# Altium schematic sheet Sheet2.SchDoc
size A4
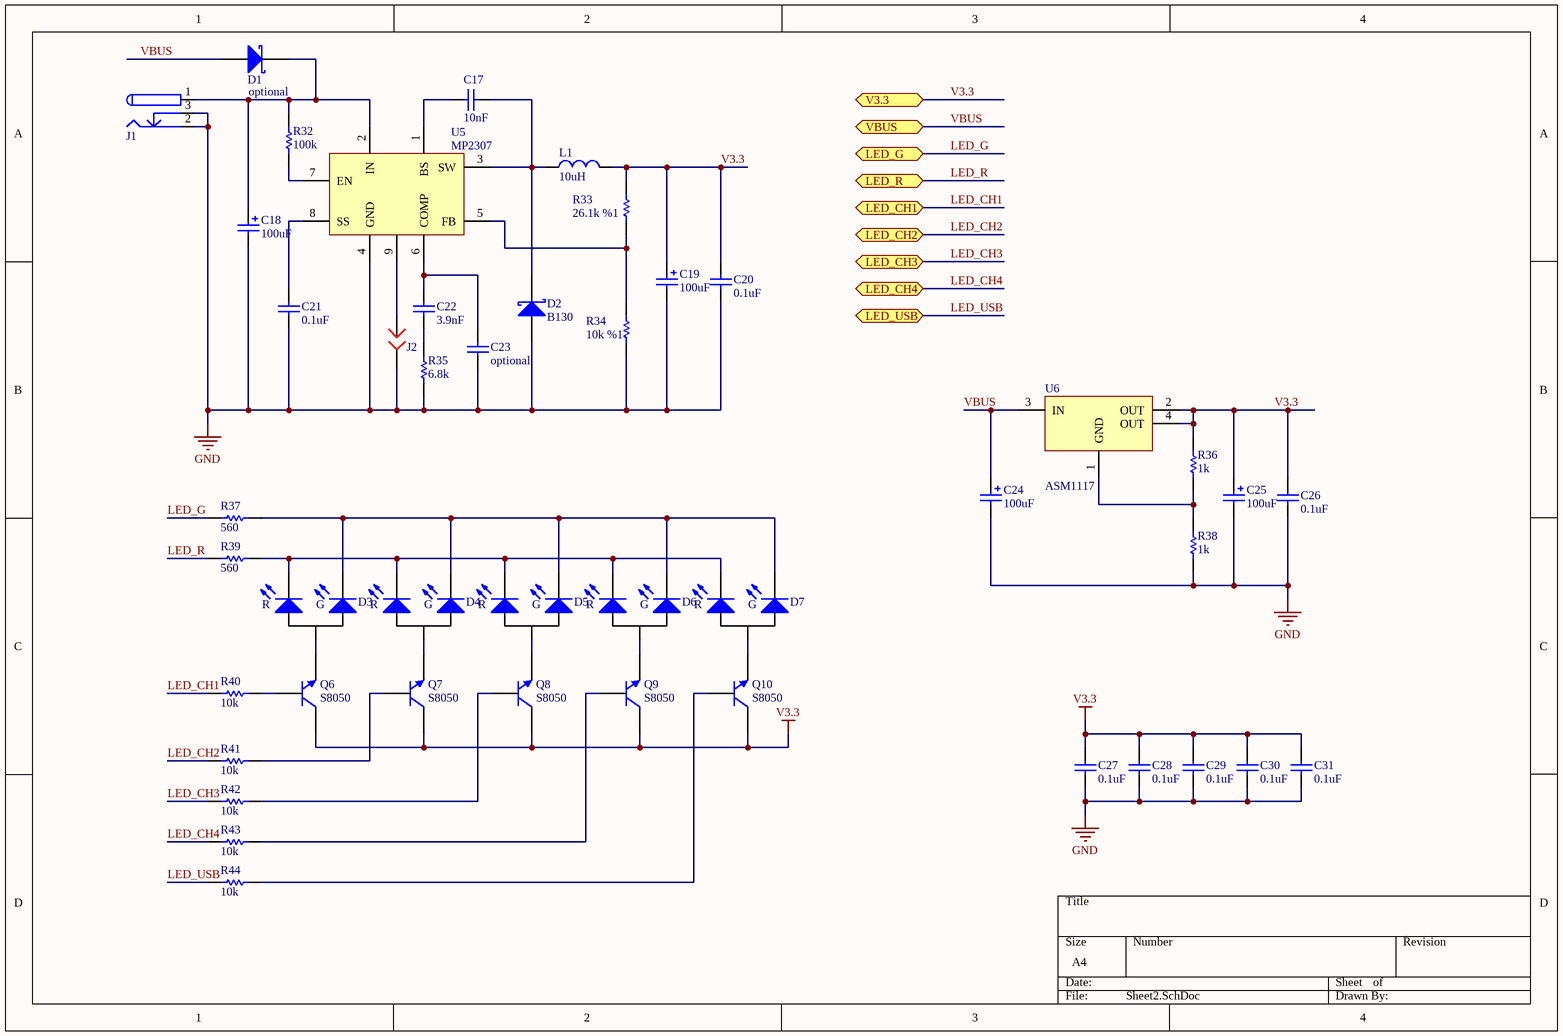
[diagram p0: Sheet2.SchDoc]

## Parts
C17  value 10nF  [0805]  (hidden comment: Cap)
C18  value 100uF  [1206A]  (hidden comment: Cap)
C19  value 100uF  [1206A]  (hidden comment: Cap)
C20  value 0.1uF  [0805]  (hidden comment: Cap)
C21  value 0.1uF  [0805]  (hidden comment: Cap)
C22  value 3.9nF  [0805]  (hidden comment: Cap)
C23  value optional  [0805]  (hidden comment: Cap)
C24  value 100uF  [0805A]  (hidden comment: Cap)
C25  value 100uF  [0805A]  (hidden comment: Cap)
C26  value 0.1uF  [0805]  (hidden comment: Cap)
C27  value 0.1uF  [0805]  (hidden comment: Cap)
C28  value 0.1uF  [0805]  (hidden comment: Cap)
C29  value 0.1uF  [0805]  (hidden comment: Cap)
C30  value 0.1uF  [0805]  (hidden comment: Cap)
C31  value 0.1uF  [0805]  (hidden comment: Cap)
D1  optional  [SMA_DO-241AC]
D2  B130  [SMA_DO-241AC]
D3  LED  [LED-D]  (value not drawn)
D4  LED  [LED-D]  (value not drawn)
D5  LED  [LED-D]  (value not drawn)
D6  LED  [LED-D]  (value not drawn)
D7  LED  [LED-D]  (value not drawn)
J1  PowerSocket  [SP_PWR]  (value not drawn)
J2  Jump  [SP_JUMP]  (value not drawn)
L1  value 10uH  [GD4520/4532]  (hidden comment: Inductance)
Q6  S8050  [SOT-23]
Q7  S8050  [SOT-23]
Q8  S8050  [SOT-23]
Q9  S8050  [SOT-23]
Q10  S8050  [SOT-23]
R32  value 100k  [0805]  (hidden comment: Res)
R33  value 26.1k %1  [0805]  (hidden comment: Res)
R34  value 10k %1  [0805]  (hidden comment: Res)
R35  value 6.8k  [0805]  (hidden comment: Res)
R36  value 1k  [0805]  (hidden comment: Res)
R37  value 560  [0805]  (hidden comment: Res)
R38  value 1k  [0805]  (hidden comment: Res)
R39  value 560  [0805]  (hidden comment: Res)
R40  value 10k  [0805]  (hidden comment: Res)
R41  value 10k  [0805]  (hidden comment: Res)
R42  value 10k  [0805]  (hidden comment: Res)
R43  value 10k  [0805]  (hidden comment: Res)
R44  value 10k  [0805]  (hidden comment: Res)
U5  MP2307  [SOIC8N]
U6  ASM1117  [SOT-223]

## Ports
LED_CH1, LED_CH2, LED_CH3, LED_CH4, LED_G, LED_R, LED_USB, V3.3, VBUS

## Nets
GND: C18.2 C19.2 C20.1 C21.1 C23.1 C24.2 C25.2 C26.1 C27.1 C28.1 C29.1 C30.1 C31.1 D2.1(A) J1.2(K) J1.3(K_NC) J2.1(C1) R34.1 R35.1 R38.1 U5.4(GND)
V3.3: C19.1 C20.2 C25.1 C26.2 C27.2 C28.2 C29.2 C30.2 C31.2 L1.2 Q6.3(C) Q7.3(C) Q8.3(C) Q9.3(C) Q10.3(C) R33.2 R36.2 U6.2(OUT) U6.4(OUT) ; port V3.3
LED_CH1: R40.2 ; port LED_CH1
LED_CH2: R41.2 ; port LED_CH2
LED_CH3: R42.2 ; port LED_CH3
LED_CH4: R43.2 ; port LED_CH4
LED_G: R37.1 ; port LED_G
LED_R: R39.1 ; port LED_R
LED_USB: R44.1 ; port LED_USB
VBUS: C24.1 D1.1(A) U6.3(IN) ; port VBUS
NetC17_1: C17.1 U5.1(BS)
NetC17_2: C17.2 D2.2(K) L1.1 U5.3(SW)
NetC18_1: C18.1 D1.2(K) J1.1(A) R32.2 U5.2(IN)
NetC21_2: C21.2 U5.8(SS)
NetC22_1: C22.1 R35.2
NetC22_2: C22.2 C23.2 U5.6(COMP)
NetD3_1: D3.1(K1) D4.1(K1) D5.1(K1) D6.1(K1) D7.1(K1) R39.2
NetD3_2: D3.2(A) Q6.2(E)
NetD3_3: D3.3(K2) D4.3(K2) D5.3(K2) D6.3(K2) D7.3(K2) R37.2
NetD4_2: D4.2(A) Q7.2(E)
NetD5_2: D5.2(A) Q8.2(E)
NetD6_2: D6.2(A) Q9.2(E)
NetD7_2: D7.2(A) Q10.2(E)
NetJ2_2: J2.2(C2) U5.9(ExPad)
NetQ6_1: Q6.1(B) R40.1
NetQ7_1: Q7.1(B) R41.1
NetQ8_1: Q8.1(B) R42.1
NetQ9_1: Q9.1(B) R43.1
NetQ10_1: Q10.1(B) R44.2
NetR32_1: R32.1 U5.7(EN)
NetR33_1: R33.1 R34.2 U5.5(FB)
NetR36_1: R36.1 R38.2 U6.1(GND)

## Notes on the sheet
- (in symbol LED2) R; G

## Library data of the parts
C18 C19 C24 C25 = Cap Pol
D1 D2 = Diode 2
D3-D7 = LED2
J1 = PWR: Power Socket